# EAGLE design driver (EAGLE 8.3.1)
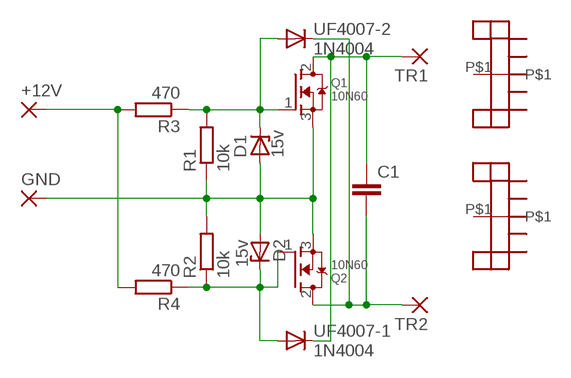
[diagram p0: schematic, sheet 1]

## Parts
+12V  3,17/1,1  [3,17/1,1]
C1  C-EU150-064X183  [C150-064X183]
D1  15v  ZENER-DIODEDO35Z10  [DO35Z10]
D2  15v  ZENER-DIODEDO35Z10  [DO35Z10]
GND  3,17/1,1  [3,17/1,1]
Q1  10N60  MOSFET-NGDS_TO220V  [TO220V]
Q2  10N60  MOSFET-NGDS_TO220V  [TO220V]
R1  10k  R-EU_0204/7  [0204/7]
R2  10k  R-EU_0204/7  [0204/7]
R3  470  R-EU_0617/17  [0617/17]
R4  470  R-EU_0617/17  [0617/17]
TR1  3,17/1,1  [3,17/1,1]
TR2  3,17/1,1  [3,17/1,1]
U$1  RADIATOR  [RAD15X11]
U$2  RADIATOR  [RAD15X11]
UF4007-1  1N4004  [DO41-10]
UF4007-2  1N4004  [DO41-10]

## Nets
N$1: D1.A D2.A GND.1(P) Q1.3(S) Q2.3(S) R1.1 R2.2
N$2: D1.C Q1.1(G) R1.2 R3.1 UF4007-2.A
N$3: +12V.1(P) R3.2 R4.2
N$4: D2.C Q2.1(G) R2.1 R4.1 UF4007-1.A
N$6: C1.1 Q1.2(D) TR1.1(P) UF4007-1.C
N$7: C1.2 Q2.2(D) TR2.1(P) UF4007-2.C
Unconnected: U$1.P$1 U$2.P$1

## Library data of the parts
+12V GND TR1 TR2 = wirepad:3,17/1,1: THROUGH-HOLE PAD
C1 = resistor:C-EU: CAPACITOR, European symbol
D1 D2 = diode:ZENER-DIODE: Z-Diode
Q1 Q2 = adafruit:MOSFET-N: N-Channel Mosfet 2N7002E - 60V 260mA SOT23 [Digikey: 2N7002ET1GOSTR-ND] - REEL BSH103 - 30V 850mA SOT23 [Digikey: 568-5013-1-ND]
R1-R4 = resistor:R-EU_: RESISTOR, European symbol
U$1 U$2 = mgvc:RADIATOR: radiator 15x11
UF4007-1 UF4007-2 = adafruit:1N4004: DIODE General purpose 1N400x type rectifier (With bigger pads) http://www.ladyada.net/library/pcb/eaglelibrary.html

## Board
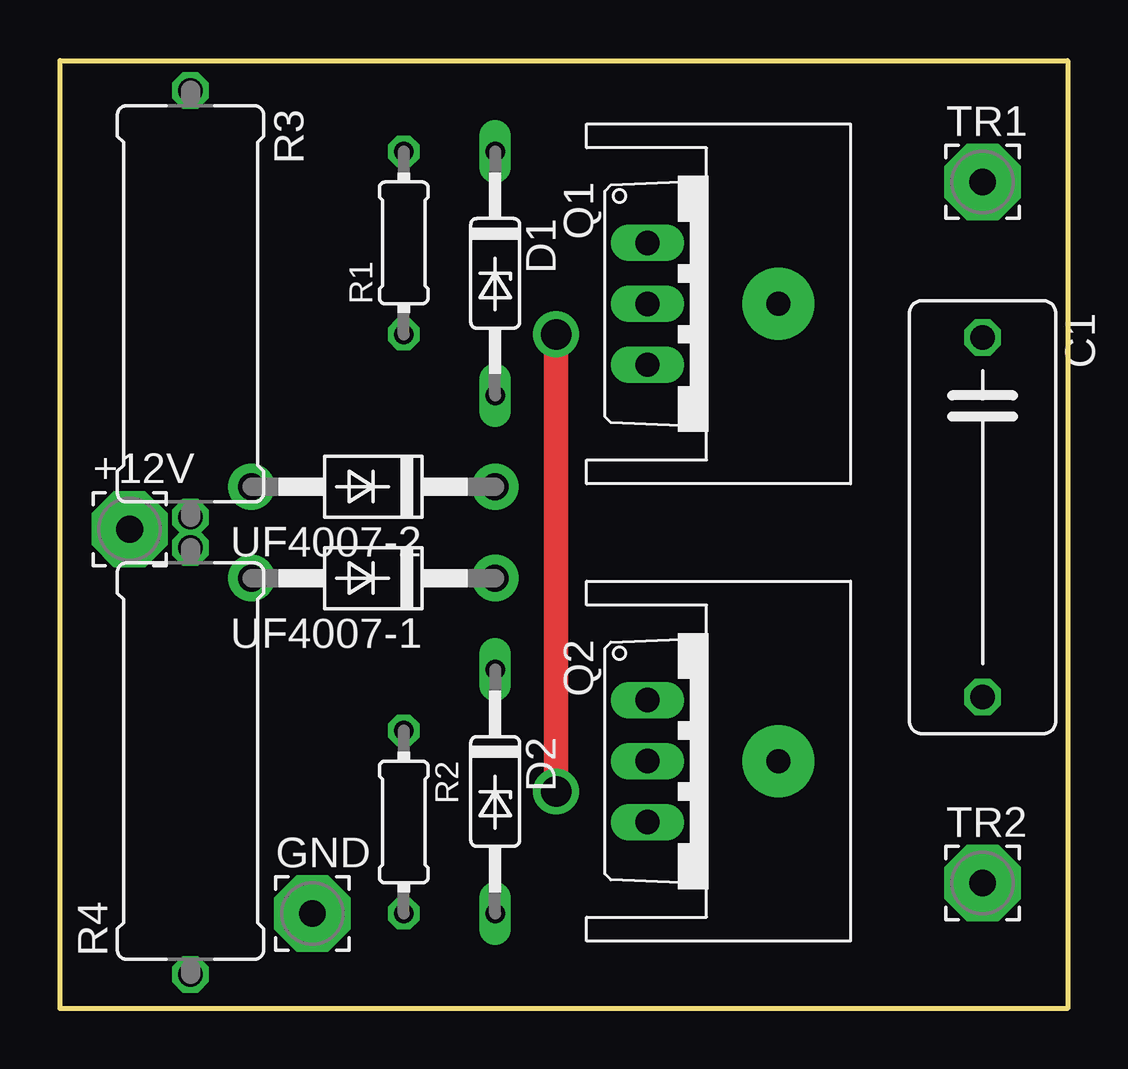
[diagram p1: board, top side]
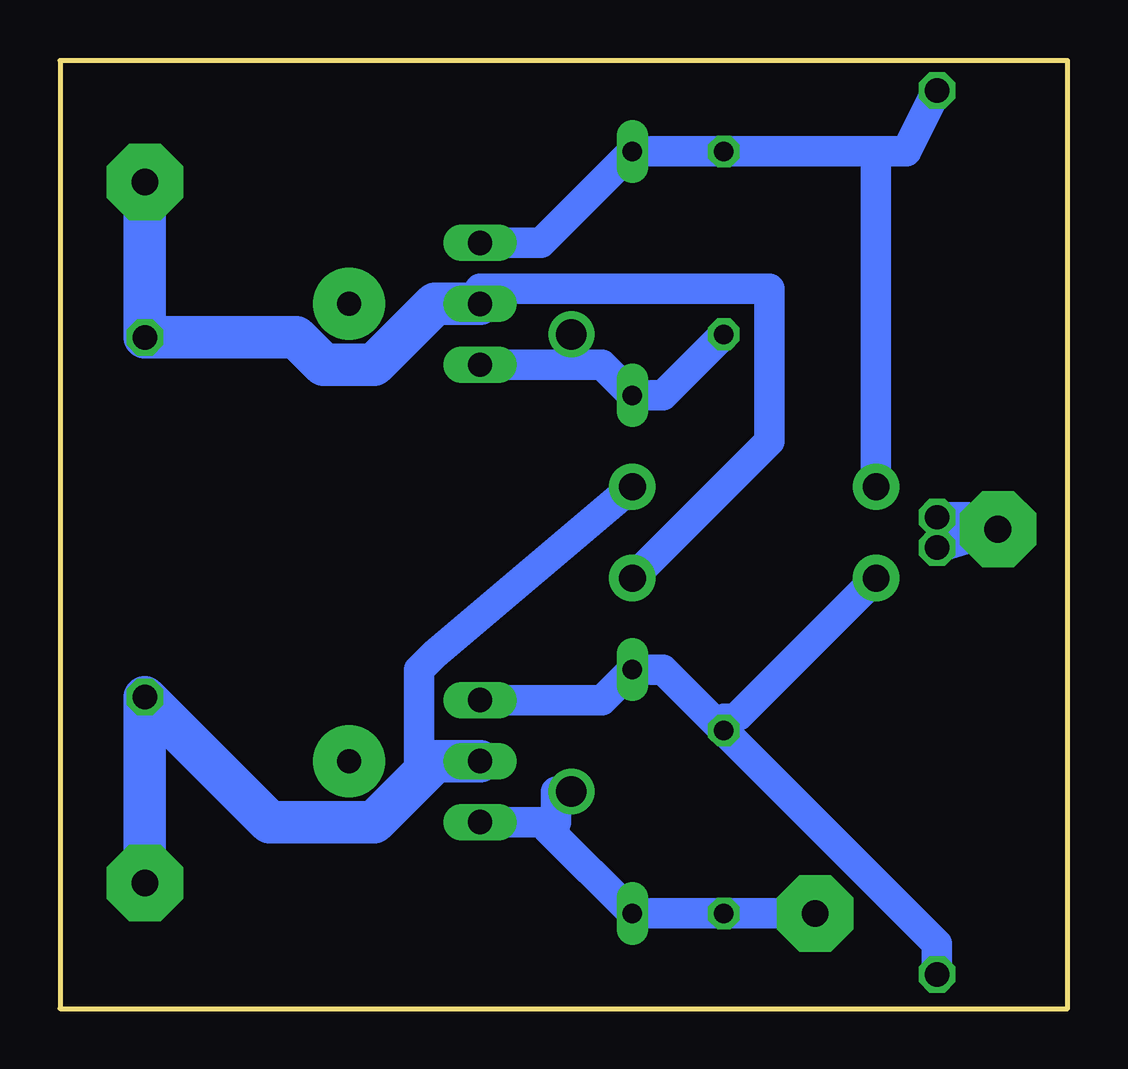
[diagram p2: board, bottom side, seen from below]

Size 42 x 39.5 mm. Coordinates in mm from the lower left corner, seen from the top.
Outline: 0,39.5 42,39.5 42,0 0,0 0,39.5
Copper layers (1*16): Top 0.035mm / dielectric 1.5mm / Bottom 0.035mm
Design rules "default *": minimum track width 1mm, minimum drill 0.35mm, track to track 6mil, track to pad 6mil, pad to pad 6mil, via to via 6mil, smd to smd 6mil, copper to edge 40mil, drill to drill 6mil, minimum pad ring 10mil, minimum via ring 8mil, stop-mask expansion 4mil, vias tented up to drill 0mil, thermal gap 10mil

### Footprints (pad centres in the part's own frame; a part is rotated, then mirrored left to right if it is on the bottom)
3,17/1,1 = drill 1.118 pad 3.175 octagon: 1 0,0
C150-064X183 = drill 1.016 octagon: 1 -7.493,0; 2 7.493,0
DO35Z10 = drill 0.813 long: A 5.08,0; C -5.08,0
TO220V = drill 1.016 long: 1 -2.54,-2.54; 2 0,-2.54; 3 2.54,-2.54
0204/7 = drill 0.813 octagon: 1 -3.81,0; 2 3.81,0
0617/17 = drill 1.016 octagon: 1 -8.89,0; 2 8.89,0
RAD15X11 = drill 1 pad 3: P$1 8,0
DO41-10 = drill 1.118 pad 1.93: A 5.08,0; C -5.08,0

### Placement (x,y rotation side)
+12V  2.9,19.98 0 top
C1  38.46,20.48 270 top
D1  18.14,30.64 270 top
D2  18.14,9.05 270 top
GND  10.52,3.97 0 top
Q1  27.03,29.37 270 top
Q2  27.03,10.32 270 top
R1  14.33,31.91 90 top
R2  14.33,7.78 270 top
R3  5.44,29.37 270 top
R4  5.44,10.32 90 top
TR1  38.46,34.45 0 top
TR2  38.46,5.24 0 top
U$1  21.95,29.37 0 top
U$2  21.95,10.32 0 top
UF4007-1  13.06,17.94 180 top
UF4007-2  13.06,21.75 180 top

### Tracks (layer width: path | path; a pad name or v marks a point on that pad's centre or on a via)
N$1  (via drill 1.27 pad 0.38, 1.27 pad 0.55)
  Top 1.016: v20.68,28.1 v20.68,9.05
  Bottom 1: v20.68,9.05 21.31,9.05 | 21.31,7.78 21.63,7.46 | v20.68,28.1 20.68,26.83
  Bottom 1.016: 21.95,7.78 21.63,7.46
  Bottom 1.27: Q1.3 20.68,26.83 19.41,26.83 D1.A 16.87,25.56 R1.1 | Q2.3 21.95,7.78 | 21.63,7.46 D2.A R2.2 GND.1 | 21.31,9.05 21.31,7.78
N$2
  Bottom 1.27: Q1.1 21.95,31.91 D1.C R1.2 7.98,35.72 | R3.1 6.71,35.72 7.98,35.72 | 7.98,35.72 UF4007-2.A
N$3
  Bottom 1: 4.17,20.48 +12V.1
  Bottom 1.27: +12V.1 R4.2 | 4.17,20.48 R3.2
N$4
  Bottom 1: 13.69,12.23 14.33,12.23 R2.1
  Bottom 1.27: Q2.1 19.41,12.86 D2.C 16.87,14.13 R2.1 5.44,2.7 R4.1 | 13.69,12.23 UF4007-1.A
N$6
  Bottom 1: 24.49,30.01 Q1.2
  Bottom 1.27: UF4007-1.C 12.42,23.66 12.42,30.01 24.49,30.01
  Bottom 1.778: Q1.2 26.36,29.37 28.9,26.83 31,26.83 32.15,27.97 C1.1 TR1.1
N$7
  Bottom 1.27: UF4007-2.C 26.39,14.77 27.03,14.13 27.03,9.65 27.1,9.58
  Bottom 1.778: Q2.2 26.36,10.32 27.1,9.58 28.9,7.78 33.25,7.78 C1.2 TR2.1